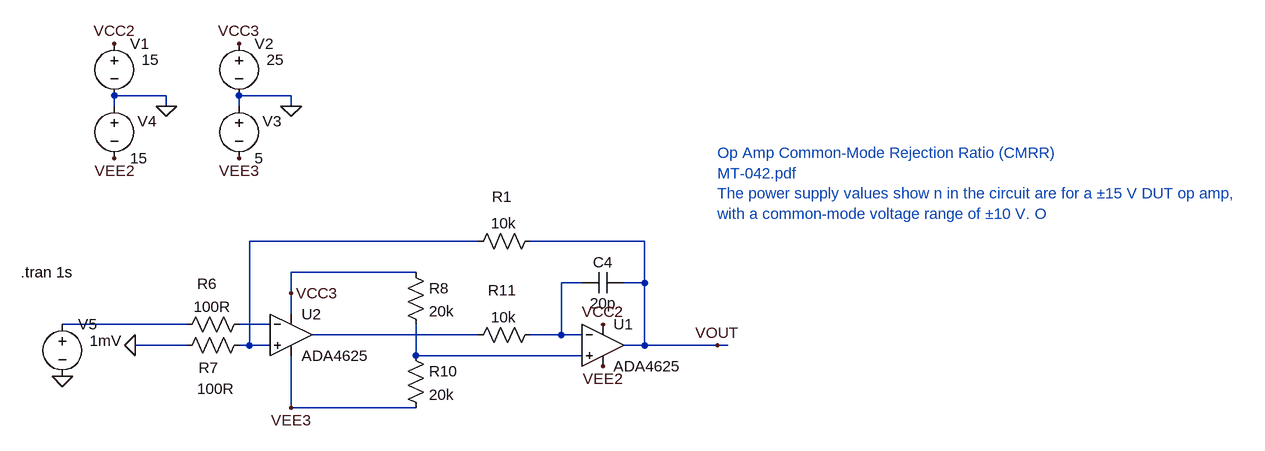
[diagram p0: schematic Draft53.asc]
Draft53.asc, the LTspice schematic file:
Version 4
SHEET 1 2668 952
WIRE 944 -304 864 -304
WIRE 1136 -304 1056 -304
WIRE 864 -288 864 -304
WIRE 944 -288 944 -304
WIRE 1056 -288 1056 -304
WIRE 1136 -288 1136 -304
WIRE 1424 -80 1072 -80
WIRE 1680 -80 1504 -80
WIRE 1328 -32 1136 -32
WIRE 1584 -16 1552 -16
WIRE 1680 -16 1680 -80
WIRE 1680 -16 1648 -16
WIRE 1136 0 1136 -32
WIRE 1136 32 1136 0
WIRE 976 48 784 48
WIRE 1104 48 1056 48
WIRE 1424 64 1168 64
WIRE 1552 64 1552 -16
WIRE 1552 64 1504 64
WIRE 1584 64 1552 64
WIRE 976 80 896 80
WIRE 1072 80 1072 -80
WIRE 1072 80 1056 80
WIRE 1104 80 1072 80
WIRE 1680 80 1680 -16
WIRE 1680 80 1648 80
WIRE 1792 80 1680 80
WIRE 1808 80 1792 80
WIRE 1328 96 1328 48
WIRE 1584 96 1328 96
WIRE 1136 176 1136 96
WIRE 1328 176 1136 176
FLAG 944 -288 0
FLAG 864 -384 VCC2
FLAG 864 -208 VEE2
FLAG 896 80 0
FLAG 1616 48 VCC2
FLAG 1616 112 VEE2
FLAG 1136 -288 0
FLAG 1056 -384 VCC3
FLAG 1056 -208 VEE3
FLAG 1136 0 VCC3
FLAG 1136 176 VEE3
FLAG 1792 80 VOUT
FLAG 784 128 0
SYMBOL voltage 864 -400 R0
WINDOW 123 0 0 Left 0
WINDOW 39 0 0 Left 0
WINDOW 3 42 41 Left 2
SYMATTR Value 15
SYMATTR InstName V1
SYMBOL voltage 864 -304 R0
WINDOW 123 0 0 Left 0
WINDOW 39 0 0 Left 0
WINDOW 0 36 39 Left 2
SYMATTR InstName V4
SYMATTR Value 15
SYMBOL OpAmps\\ADA4625 1136 0 R0
SYMATTR InstName U2
SYMBOL res 1072 32 R90
WINDOW 0 -31 65 VBottom 2
WINDOW 3 -27 57 VTop 2
SYMATTR InstName R6
SYMATTR Value 100R
SYMBOL res 1072 64 R90
WINDOW 0 66 63 VBottom 2
WINDOW 3 67 52 VTop 2
SYMATTR InstName R7
SYMATTR Value 100R
SYMBOL res 1312 -48 R0
SYMATTR InstName R8
SYMATTR Value 20k
SYMBOL res 1312 80 R0
SYMATTR InstName R10
SYMATTR Value 20k
SYMBOL voltage 1056 -400 R0
WINDOW 123 0 0 Left 0
WINDOW 39 0 0 Left 0
WINDOW 3 42 41 Left 2
SYMATTR Value 25
SYMATTR InstName V2
SYMBOL voltage 1056 -304 R0
WINDOW 123 0 0 Left 0
WINDOW 39 0 0 Left 0
WINDOW 0 36 39 Left 2
SYMATTR InstName V3
SYMATTR Value 5
SYMBOL cap 1648 -32 R90
WINDOW 0 0 32 VBottom 2
WINDOW 3 32 32 VTop 2
SYMATTR InstName C4
SYMATTR Value 20p
SYMBOL res 1520 48 R90
WINDOW 0 -37 59 VBottom 2
WINDOW 3 -27 57 VTop 2
SYMATTR InstName R11
SYMATTR Value 10k
SYMBOL res 1520 -96 R90
WINDOW 0 -37 59 VBottom 2
WINDOW 3 -27 57 VTop 2
SYMATTR InstName R1
SYMATTR Value 10k
SYMBOL OpAmps\\ADA4625 1616 16 R0
SYMATTR InstName U1
SYMBOL voltage 784 32 R0
WINDOW 123 0 0 Left 0
WINDOW 39 0 0 Left 0
WINDOW 3 42 41 Left 2
SYMATTR Value 1mV
SYMATTR InstName V5
TEXT 720 -32 Left 2 !.tran 1s
TEXT 1792 -216 Left 2 ;Op Amp Common-Mode Rejection Ratio (CMRR)\nMT-042.pdf\nThe power supply values show n in the circuit are for a ±15 V DUT op amp, \nwith a common-mode voltage range of ±10 V. O

The netlist it stands for:
* Draft53.asc
V1 VCC2 0 15
V4 0 VEE2 15
XU2 N001 N004 VCC3 VEE3 N005 ADA4625  ; pins In+ In- V+ V- OUT
R6 N004 N003 100R
R7 N001 0 100R
R8 VCC3 N006 20k
R10 N006 VEE3 20k
V2 VCC3 0 25
V3 0 VEE3 5
C4 VOUT N002 20p
R11 N002 N005 10k
R1 VOUT N001 10k
XU1 N006 N002 VCC2 VEE2 VOUT ADA4625  ; pins In+ In- V+ V- OUT
V5 N003 0 1mV
.tran 1s
* Op Amp Common-Mode Rejection Ratio (CMRR)
* MT-042.pdf
* The power supply values show n in the circuit are for a ±15 V DUT op amp,
* with a common-mode voltage range of ±10 V. O
.backanno
.end